# EAGLE schematic Amplificador (EAGLE 9.6.2)
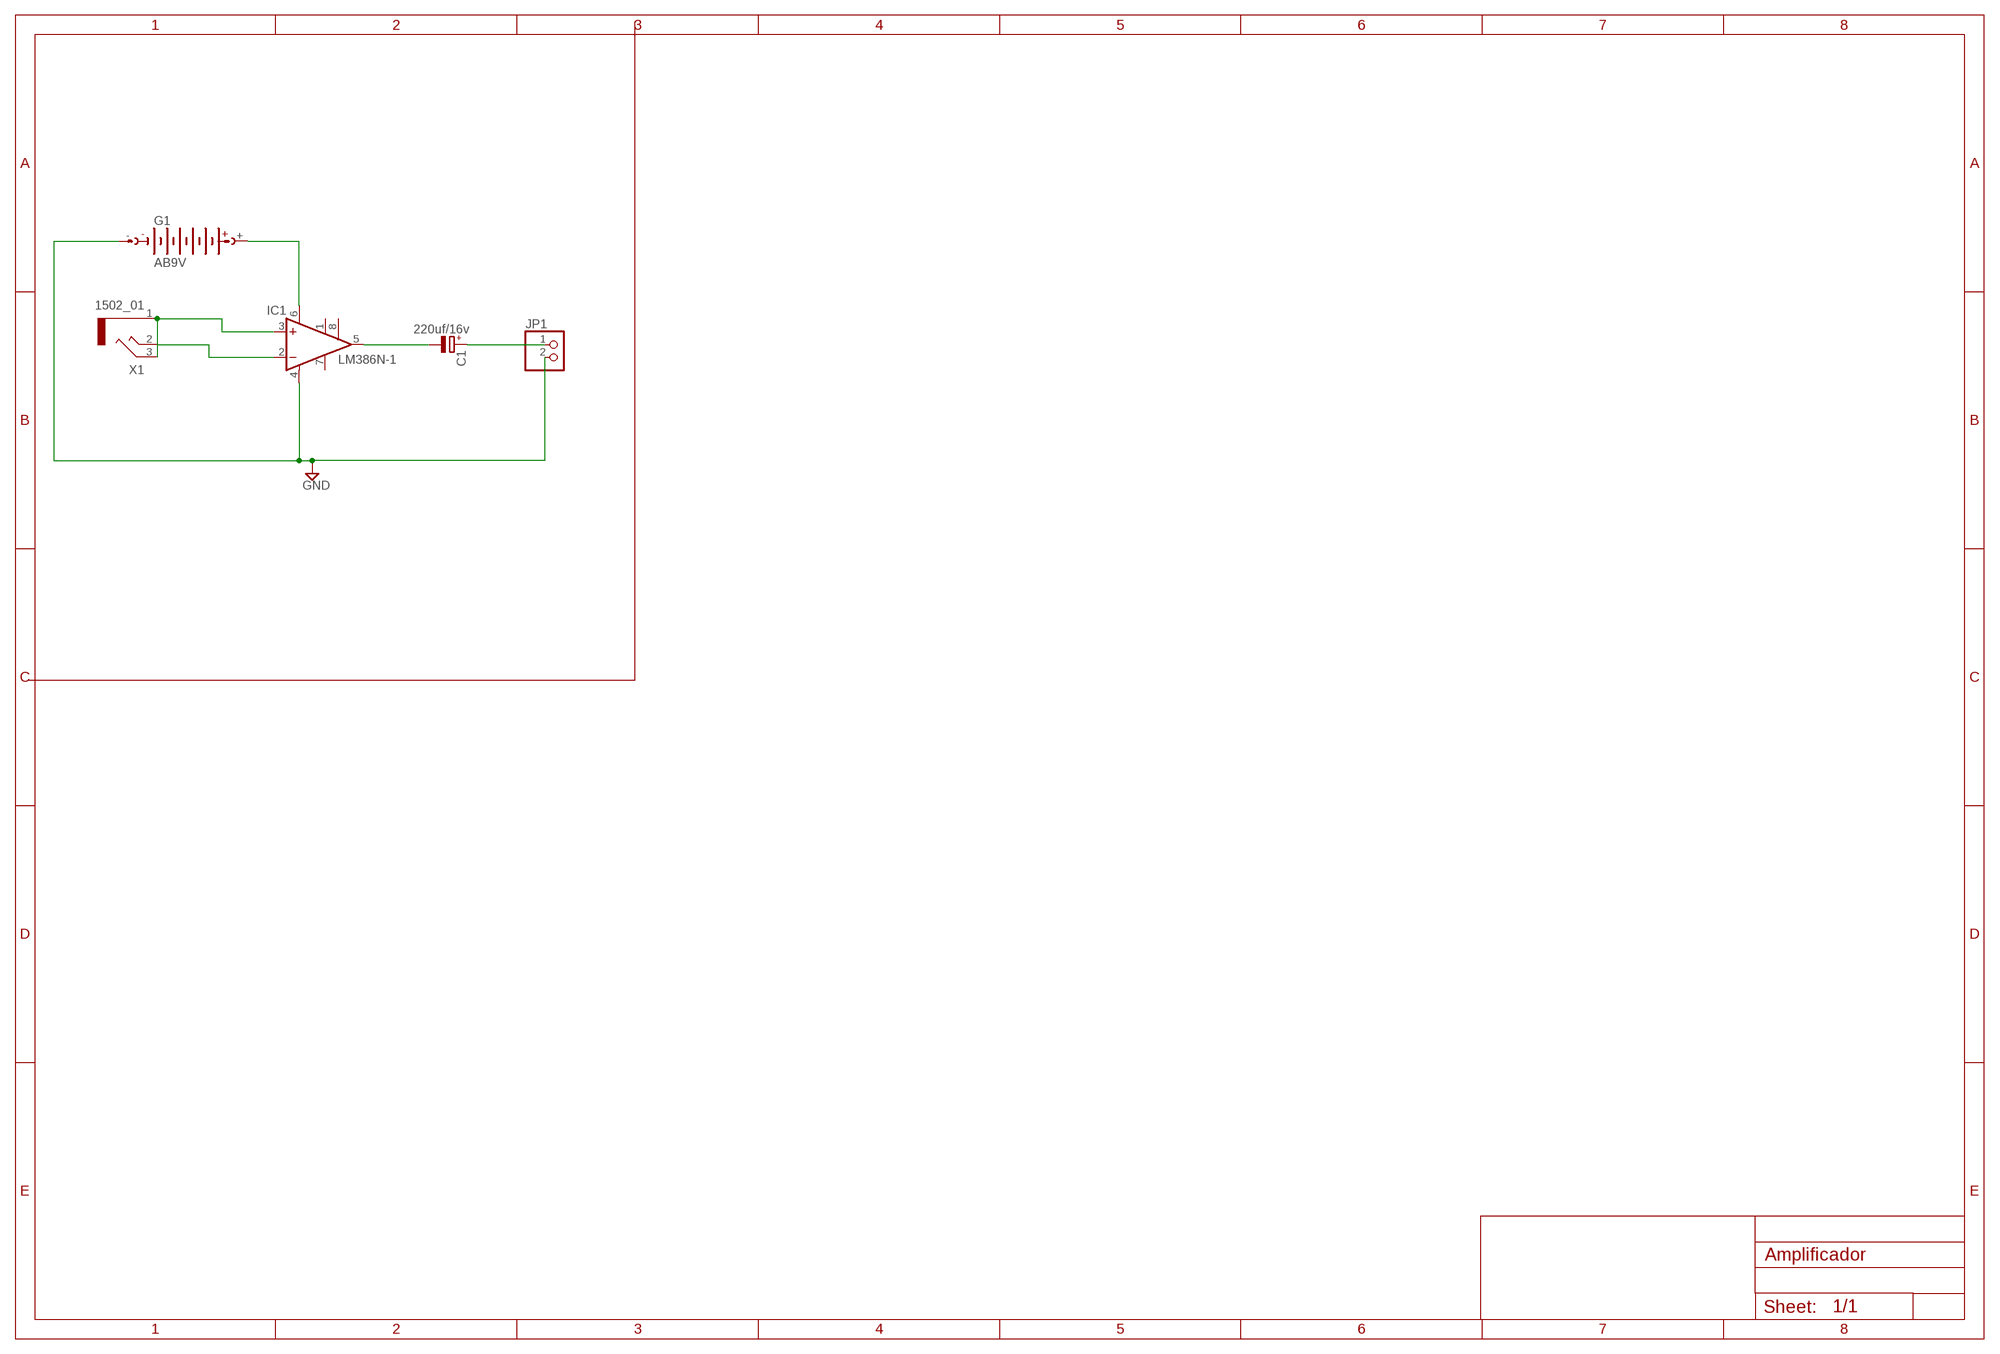
[diagram p0: schematic, sheet 1]

## Parts
C1  220uf/16v  CPOL-EUE3.5-8  [E3,5-8]
G1  AB9V  [AB9V]
IC1  LM386N-1  [DIL08]
JP1  PINHD-1X2  [1X02]
X1  1502_01  [1502_01]

## Nets
GND: G1.- IC1.4(GND) JP1.2
N$1: IC1.2(-IN) X1.2
N$2: IC1.3(+IN) X1.1 X1.3
N$3: G1.+ IC1.6(VS)
N$4: C1.- IC1.5(OUT)
N$5: C1.+ JP1.1
Unconnected: IC1.1(GAIN) IC1.7(BYPASS) IC1.8(GAIN)

## Library data of the parts
C1 = rcl:CPOL-EU: POLARIZED CAPACITOR, European symbol; SPICEPREFIX: C
G1 = battery:AB9V: 9-V BATTERY CLIP
IC1 = linear:LM386?-*: Low Voltage Audio Power Amplifier Source: http://cache.national.com/ds/LM/LM386.pdf
JP1 = pinhead:PINHD-1X2: PIN HEADER
X1 = con-lumberg:1502_01: Jack connectors according to JISC 6560, 3.5 mm Klinkensteckverbinder nach JISC 6560, 3,5 mm Source: http://www.lumberg.com/Produkte/PDFs/1502_01.pdf; OC_FARNELL: 4739747; OC_NEWARK: unknown